# EAGLE schematic mcu_brd (EAGLE 7.7.0)

## Sheet 1 of 2: Power Supply Sheet
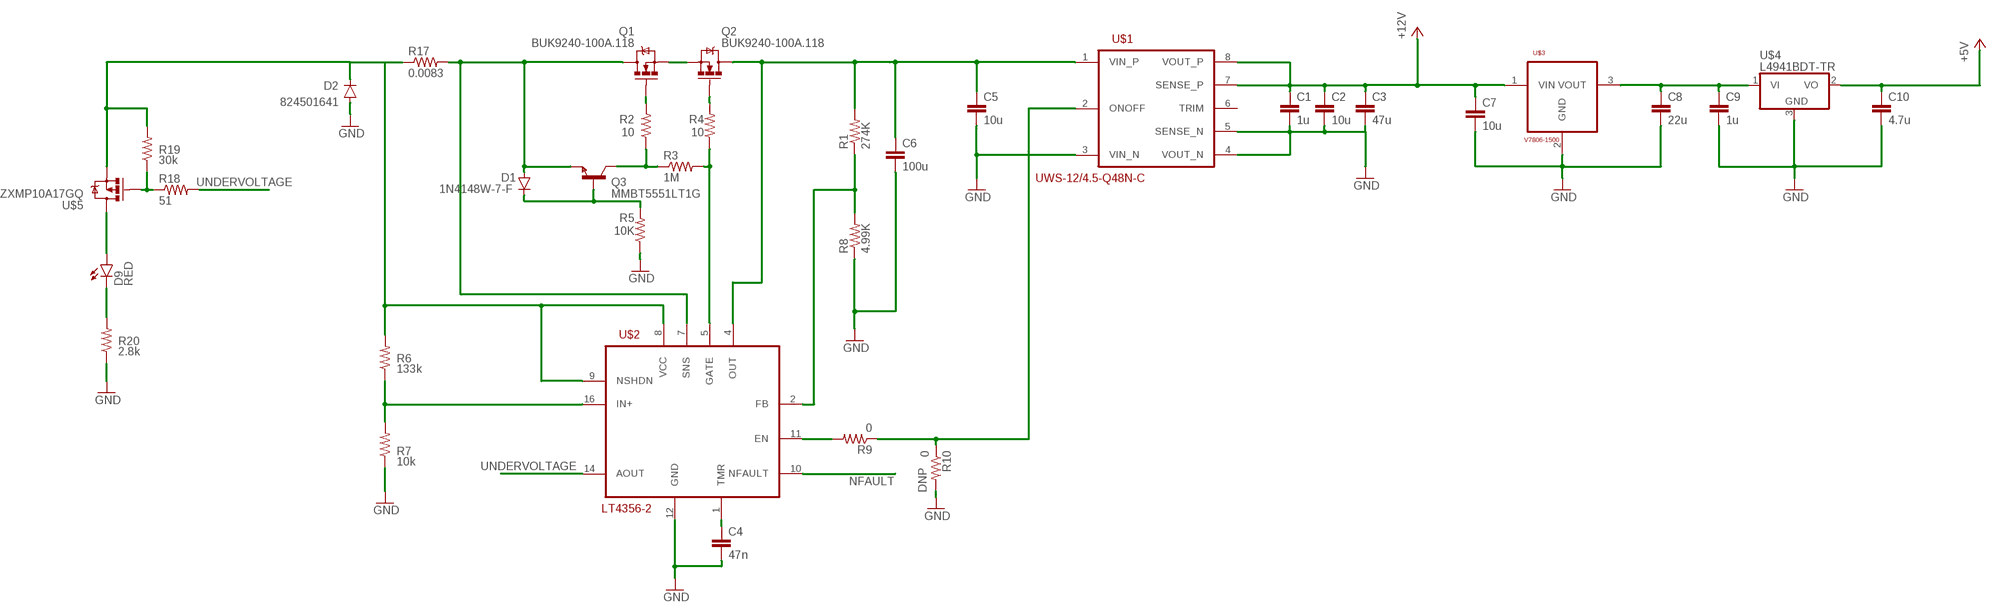
[diagram p0: schematic, sheet 1]

### Parts
C1  1u  CAP1206  [1206]
C2  10u  CAP1206  [1206]
C3  47u  CAP1206  [1206]
C4  47n  CAP0805  [0805]
C5  10u  CAP1210  [1210]
C6  100u  CAP1210  [1210]
C7  10u  CAP1206  [1206]
C8  22u  CAP1206  [1206]
C9  1u  CAP1206  [1206]
C10  4.7u  CAP1206  [1206]
D1  1N4148W-7-F  DIODESOD123  [SOD-123]
D2  824501641  DIODESMA-ALT  [SMA-DIODE_ALT]
D9  RED  LED-RED1206  [LED-1206]
Q1  BUK9240-100A.118  MOSFET-NCHANNELFDD8780  [DPAK]
Q2  BUK9240-100A.118  MOSFET-NCHANNELFDD8780  [DPAK]
Q3  MMBT5551LT1G  TRANSISTOR_NPNMMBT2222A  [SOT23-3]
R1  274K  RESISTOR1206  [1206]
R2  10  RESISTOR1206  [1206]
R3  1M  RESISTOR1206  [1206]
R4  10  RESISTOR1206  [1206]
R5  10K  RESISTOR1206  [1206]
R6  133k  RESISTOR1206  [1206]
R7  10k  RESISTOR1206  [1206]
R8  4.99K  RESISTOR1206  [1206]
R9  0  RESISTOR0805-RES  [0805]
R10  0  RESISTOR0805-RES  [0805]
R17  0.0083  RESISTOR2010  [R2010]
R18  51  RESISTOR2010  [R2010]
R19  30k  RESISTOR1206  [1206]
R20  2.8k  RESISTOR1206  [1206]
U$1  UWS-12/4.5-Q48N-C  [DOSA1_16]
U$2  LT4356-2  LT4356-1  [SOIC-16]
U$3  V7806-1500  [V7806]
U$4  L4941BDT-TR  7805DT  [TO252]
U$5  ZXMP10A17GQ  [SOT223]

### Nets
+5V: C10.1 U$4.2(VO) ; also sheet 2
+12V: C1.1 C2.1 C3.1 C7.1 U$1.7(SENSE_P) U$1.8(VOUT_P) U$3.1(VIN)
GND: C1.2 C2.2 C3.2 C4.2 C5.2 C6.2 C7.2 C8.2 C9.2 C10.2 D2.A R5.1 R7.1 R8.1 R10.2 R20.1 U$1.3(VIN_N) U$1.4(VOUT_N) U$1.5(SENSE_N) U$2.12(GND) U$3.2(GND) U$4.3(GND) ; also sheet 2
N$1: C4.1 U$2.1(TMR)
N$2: R9.2 U$2.11(EN)
N$3: C5.1 C6.1 Q2.4(D) R1.2 U$1.1(VIN_P) U$2.4(OUT)
N$5: Q1.3(S) Q2.3(S)
N$6: Q3.3(C) R2.1 R3.1
N$7: R3.2 R4.1 U$2.5(GATE)
N$8: D1.A Q1.4(D) Q3.2(E) R17.2 U$2.7(SNS)
N$9: D1.C Q3.1(B) R5.2
N$10: Q1.1(G) R2.2
N$11: Q2.1(G) R4.2
N$12: D2.C R6.2 R17.1 R19.2 U$2.8(VCC) U$2.9(NSHDN) U$5.3(S)
N$13: R6.1 R7.2 U$2.16(IN+)
N$14: R1.1 R8.2 U$2.2(FB)
N$15: R9.1 R10.1 U$1.2(ONOFF)
N$16: C8.1 C9.1 U$3.3(VOUT) U$4.1(VI)
N$19: R18.1 R19.1 U$5.1(G)
N$21: D9.C R20.2
N$22: D9.A U$5.2(D) U$5.4(D)
NFAULT: U$2.10(NFAULT)
UNDERVOLTAGE: R18.2 U$2.14(AOUT)
Unconnected: U$1.6(TRIM)

## Sheet 2 of 2: Hall Effect Input
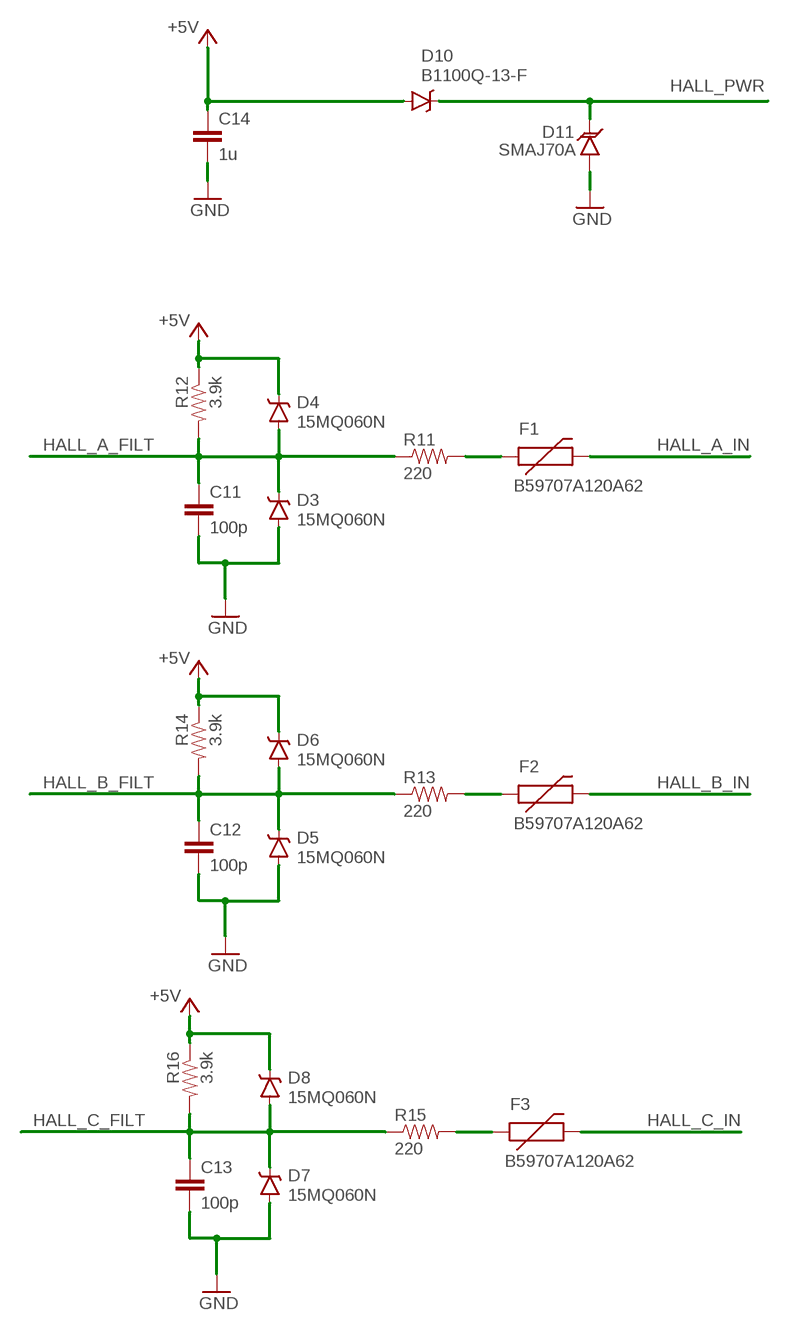
[diagram p1: schematic, sheet 2]

### Parts
C11  100p  CAP1206  [1206]
C12  100p  CAP1206  [1206]
C13  100p  CAP1206  [1206]
C14  1u  CAP1206  [1206]
D3  15MQ060N  DIODE-SCHOTTKY-B340A  [SMA-DIODE]
D4  15MQ060N  DIODE-SCHOTTKY-B340A  [SMA-DIODE]
D5  15MQ060N  DIODE-SCHOTTKY-B340A  [SMA-DIODE]
D6  15MQ060N  DIODE-SCHOTTKY-B340A  [SMA-DIODE]
D7  15MQ060N  DIODE-SCHOTTKY-B340A  [SMA-DIODE]
D8  15MQ060N  DIODE-SCHOTTKY-B340A  [SMA-DIODE]
D10  B1100Q-13-F  DIODE-SCHOTTKY-MBRA140  [SMA-DIODE]
D11  SMAJ70A  TVSSMA  [SMA-DIODE]
F1  B59707A120A62  PTCSMD  [PTC-1206]
F2  B59707A120A62  PTCSMD  [PTC-1206]
F3  B59707A120A62  PTCSMD  [PTC-1206]
R11  220  RESISTOR1206  [1206]
R12  3.9k  RESISTOR1206  [1206]
R13  220  RESISTOR1206  [1206]
R14  3.9k  RESISTOR1206  [1206]
R15  220  RESISTOR1206  [1206]
R16  3.9k  RESISTOR1206  [1206]

### Nets
+5V: C14.1 D4.C D6.C D8.C D10.A R12.1 R14.1 R16.1 ; also sheet 1
GND: C11.2 C12.2 C13.2 C14.2 D3.A D5.A D7.A D11.A ; also sheet 1
HALL_A_FILT: C11.1 D3.C D4.A R11.1 R12.2
HALL_A_IN: F1.2
HALL_B_FILT: C12.1 D5.C D6.A R13.1 R14.2
HALL_B_IN: F2.2
HALL_C_FILT: C13.1 D7.C D8.A R15.1 R16.2
HALL_C_IN: F3.2
HALL_PWR: D10.C D11.C
N$4: F2.1 R13.2
N$17: F1.1 R11.2
N$18: F3.1 R15.2

## Library data of the parts
C1-C14 = SparkFun-Capacitors:CAP: Capacitor Standard 0603 ceramic capacitor, and 0.1" leaded capacitor.
D1 D2 = SparkFun-DiscreteSemi:DIODE: Diode These are standard reverse protection diodes and small signal diodes. SMA package can handle up to about 1A. SOD-323 can handle about 200mA. What the SOD-323 package when ordering, there are some mfgs out there that are 5-pin packages.
D3-D8 = SparkFun-DiscreteSemi:DIODE-SCHOTTKY: Schottky diodes in SFE's production catalog BAT20J 1A 23V 0.62Vf RB751 120mA 40V 0.37Vf PMEG4005EJ 0.5A 40V 0.42Vf MBRA140 1A 40V 0.5Vf B340A 3A 40V SMA; PROD_ID: DIO-09886; VALUE: B340A
D9 = SparkFun-LED:LED-RED: Assorted Red LEDs LilyPad 1206- DIO-09912 1206- DIO-00809 0603- DIO-00819; PROD_ID: DIO-00809
D10 = SparkFun-DiscreteSemi:DIODE-SCHOTTKY: Schottky diodes in SFE's production catalog BAT20J 1A 23V 0.62Vf RB751 120mA 40V 0.37Vf PMEG4005EJ 0.5A 40V 0.42Vf MBRA140 1A 40V 0.5Vf B340A 3A 40V SMA; PROD_ID: DIO-08053; VALUE: MBRA140
D11 = SparkFun-DiscreteSemi:TVS: Transient voltage suppressor- prevents ESD on inputs.
F1-F3 = SparkFun-PowerIC:PTC: Resettable Fuse PTC Resettable Fuse. Spark Fun Electronics SKU : COM-08357; PROD_ID: RES-11150
Q1 Q2 = SparkFun-DiscreteSemi:MOSFET-NCHANNEL: Common NMOSFET Parts MFG P/N Store ID Prod ID FDD8780 TRANS-09984 SI7820DN TRANS-11055 FDS6630A IC-08089 2N7002PW TRANS-11151 FQP30N06L COM-10213 TRANS-10060 BSS123LT1G TRANS-08345 BSS138 TRANS-00830 BS170 2N7000; PROD_ID: TRANS-09984
Q3 = SparkFun-DiscreteSemi:TRANSISTOR_NPN: Generic NPN BJT MMBT2222A - TRANS-08049 (SOT-23, 1A 40V) MPSA42 - TRANS-09116 (SOT-23, 500mA 300V) MMBT5088LT1G - TRANS-11160 (SOT-23, 50 mA 30V) BC547 - COM-08928 <http://www.sparkfun.com/products/8928> (TO-92 45V 100mA) (1.Collector 2.Base 3.Emitter) 2N3904 - COM-00521 <http://www.sparkfun.com/products/521> (TO-92 40V 200mA) (1.Emitter 2.Base 3.Collector) P2N2222A - COM-12852 <http://www.sparkfun.com/products/12852> (TO-92 40V 600mA) (1.Collector 2.Base 3.Emitter); PROD_ID: TRANS-08049; VALUE: MMBT2222A
R1-R20 = SparkFun-Resistors:RESISTOR: Resistor Basic schematic elements and footprints for 0603, 1206, and PTH resistors.
U$1 = dp_devices:UWS-12/4.5-Q48N-C
U$2 = dp_devices:LT4356-1
U$3 = dp_devices:V7806-1500
U$4 = linear:78*: Positive VOLTAGE REGULATOR Source: http://cache.national.com/ds/LM/LM78L05.pdf http://www.fairchildsemi.com/ds/LM/LM7805.pdf
U$5 = SparkFun-DiscreteSemi:ZXMP10A17GQ